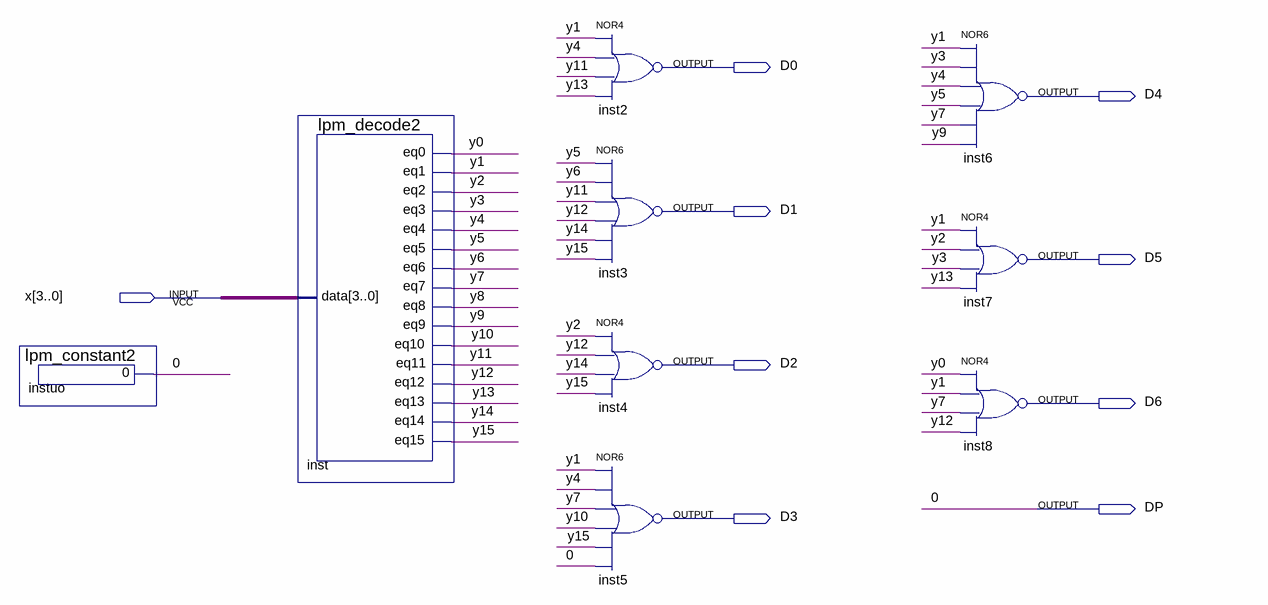
[diagram p0: schematic sheet]
// Quartus schematic lab2_chap2.bdf as structural Verilog: 9 symbols, 9 pins
module lab2_chap2 (
  input  [3:0] x,
  output D0,
  output D4,
  output D1,
  output D5,
  output D2,
  output D6,
  output DP,
  output D3
);

  wire y0, y1, y2, y3, y4, y5, y6, y7, y8, y9, y10, y11, y12, y13, y14, y15;

  lpm_constant2 instuo (.result(DP));
  lpm_decode2 inst (
    .data(x), .eq0(y0), .eq1(y1), .eq2(y2), .eq3(y3), .eq4(y4), .eq5(y5), .eq6(y6), .eq7(y7), .eq8(y8),
    .eq9(y9), .eq10(y10), .eq11(y11), .eq12(y12), .eq13(y13), .eq14(y14), .eq15(y15));
  nor inst2 (D0, y1, y4, y11, y13);
  nor inst3 (D1, y5, y6, y11, y12, y14, y15);
  nor inst4 (D2, y2, y12, y14, y15);
  nor inst5 (D3, y1, y4, y7, y10, y15, DP);
  nor inst6 (D4, y1, y3, y4, y5, y7, y9);
  nor inst7 (D5, y1, y2, y3, y13);
  nor inst8 (D6, y0, y1, y7, y12);

  // Other names for the same wires on the sheet: 0 = DP
endmodule
